# Altium schematic sheet Fuentes.SchDoc
size A4; SheetNumber: 5; SheetTotal: 5
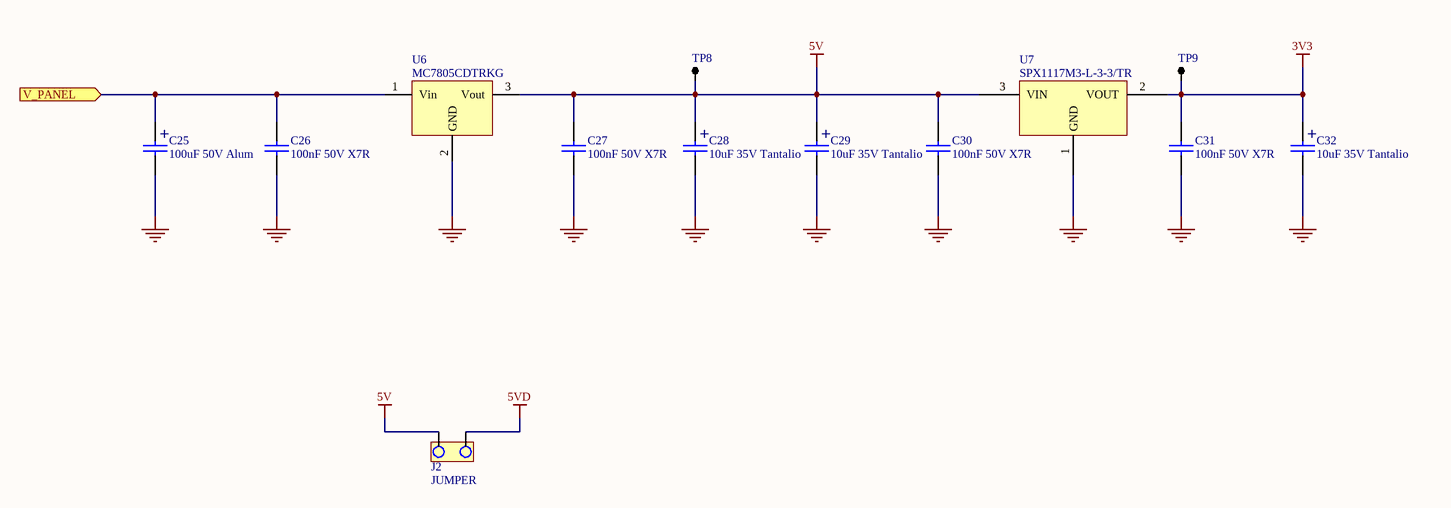
[diagram p0: Fuentes.SchDoc]

## Parts
C25  100uF 50V Alum  [CAPSMD8x8.3]
C26  100nF 50V X7R  [0805]
C27  100nF 50V X7R  [0805]
C28  10uF 35V Tantalio  [CAPPOL1210]
C29  10uF 35V Tantalio  [CAPPOL1210]
C30  100nF 50V X7R  [0805]
C31  100nF 50V X7R  [0805]
C32  10uF 35V Tantalio  [CAPPOL1210]
J2  JUMPER  [0805]
TP8  TP  [TP_COMPACT]  (value not drawn)
TP9  TP  [TP_COMPACT]  (value not drawn)
U6  MC7805CDTRKG  [dpak]
U7  SPX1117M3-L-3-3/TR  [SOT223]

## Ports
V_PANEL (in, see MainSCH[3A], Bucks[1A], Filtros[2A])

## Nets
3V3: C31.1 C32.1 TP9.1 U7.2(VOUT)
5V: C27.1 C28.1 C29.1 C30.2 J2.1 TP8.1 U6.3(Vout) U7.3(VIN)
5VD: J2.2
GND: C25.2 C26.2 C27.2 C28.2 C29.2 C30.1 C31.2 C32.2 U6.2(GND) U7.1(GND)
V_PANEL: C25.1 C26.1 U6.1(Vin) ; port V_PANEL

## Notes on the sheet
- (in symbol CAPPOL) +

## Library data of the parts
C25 = CAPPOL: UWZ1H101MCL1GS
C26 C27 C30 C31 = CAP
C28 C29 C32 = CAPPOL: TCJB106M035R0200
U6 = LM78XX
U7 = LIN_REG